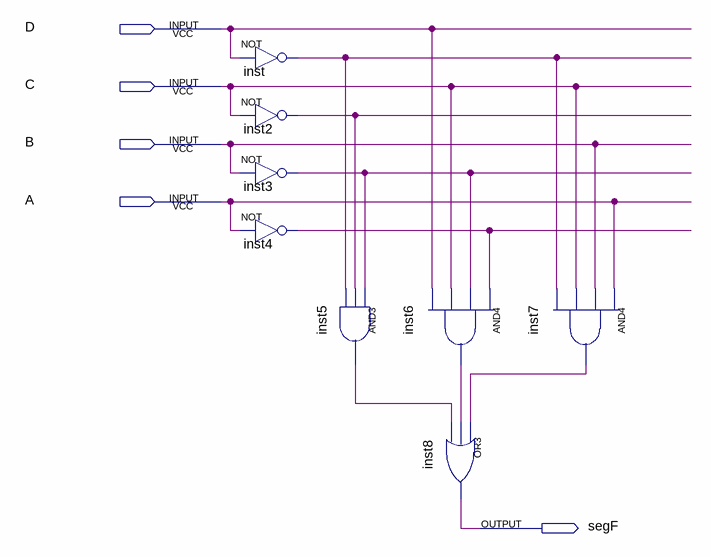
[diagram p0: schematic sheet]
// Quartus schematic sgeG.bdf as structural Verilog: 8 symbols, 5 pins
module sgeG (
  input  D,
  input  C,
  input  B,
  input  A,
  output segF
);

  wire inst2_out, inst3_out, inst4_out, inst5_out, inst6_out, inst7_out, inst_out;

  not inst (inst_out, D);
  not inst2 (inst2_out, C);
  not inst3 (inst3_out, B);
  not inst4 (inst4_out, A);
  and inst5 (inst5_out, inst3_out, inst2_out, inst_out);
  and inst6 (inst6_out, inst4_out, inst3_out, C, D);
  or inst8 (segF, inst7_out, inst6_out, inst5_out);
  and inst7 (inst7_out, A, B, C, inst_out);
endmodule
